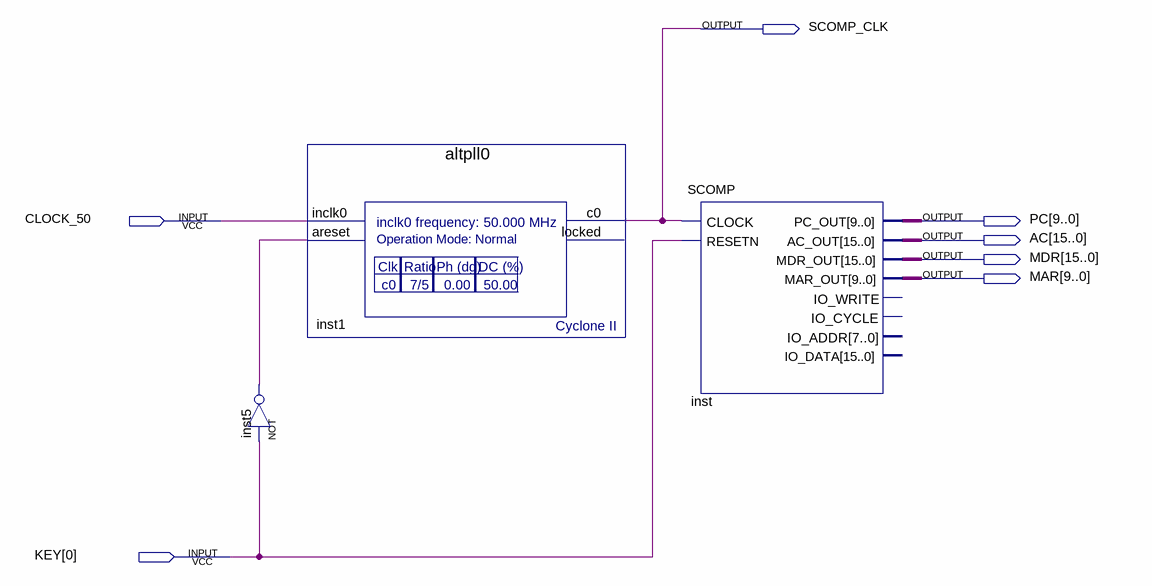
[diagram p0: schematic sheet]
// Quartus schematic TOP_SCOMP.bdf as structural Verilog: 3 symbols, 7 pins
module TOP_SCOMP (
  input  CLOCK_50,
  input  [0:0] KEY,
  output SCOMP_CLK,
  output [9:0] PC,
  output [15:0] AC,
  output [15:0] MDR,
  output [9:0] MAR
);

  wire inst5_out;

  not inst5 (inst5_out, KEY[0]);
  altpll0 inst1 (.inclk0(CLOCK_50), .areset(inst5_out), .c0(SCOMP_CLK));  // open: locked
  SCOMP inst (
    .CLOCK(SCOMP_CLK), .RESETN(KEY[0]), .PC_OUT(PC), .AC_OUT(AC), .MDR_OUT(MDR), .MAR_OUT(MAR));  // open: IO_WRITE, IO_CYCLE, IO_ADDR, IO_DATA
endmodule
